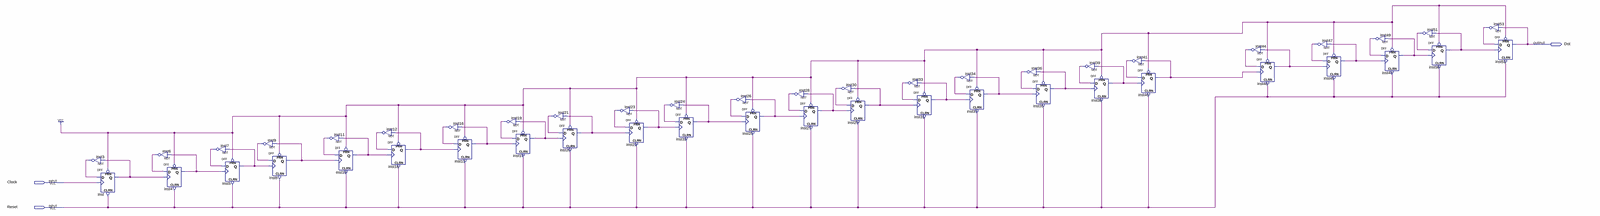
[diagram p0: schematic sheet, whole]
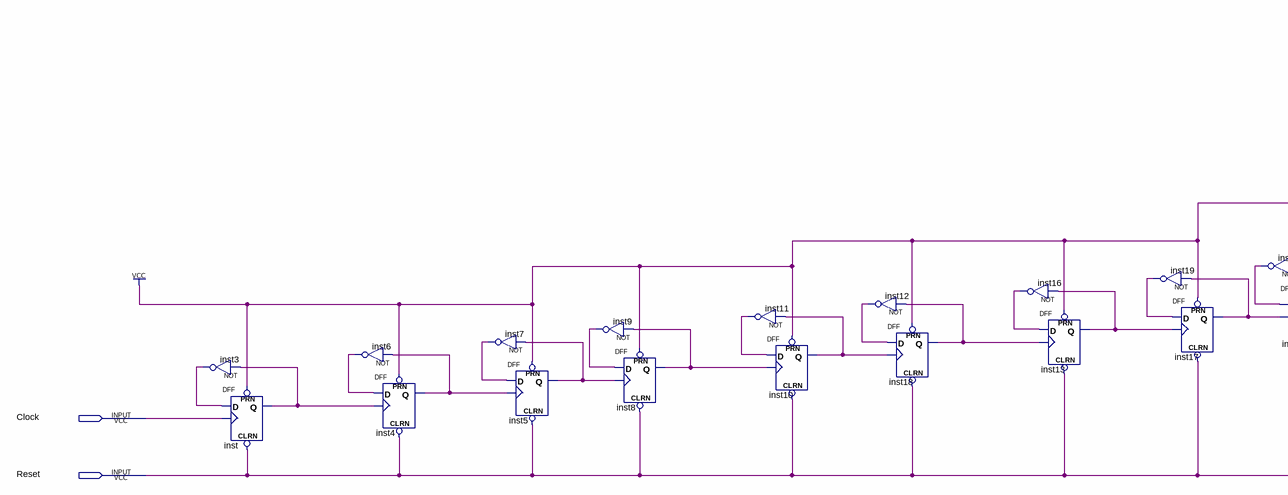
[diagram p1: schematic sheet, left part]
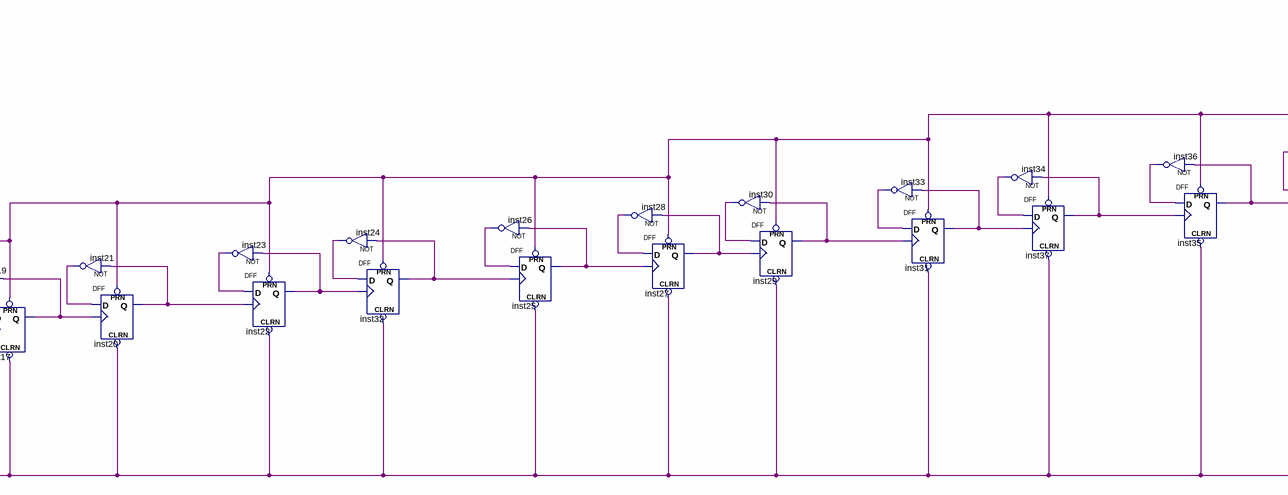
[diagram p2: schematic sheet, centre part]
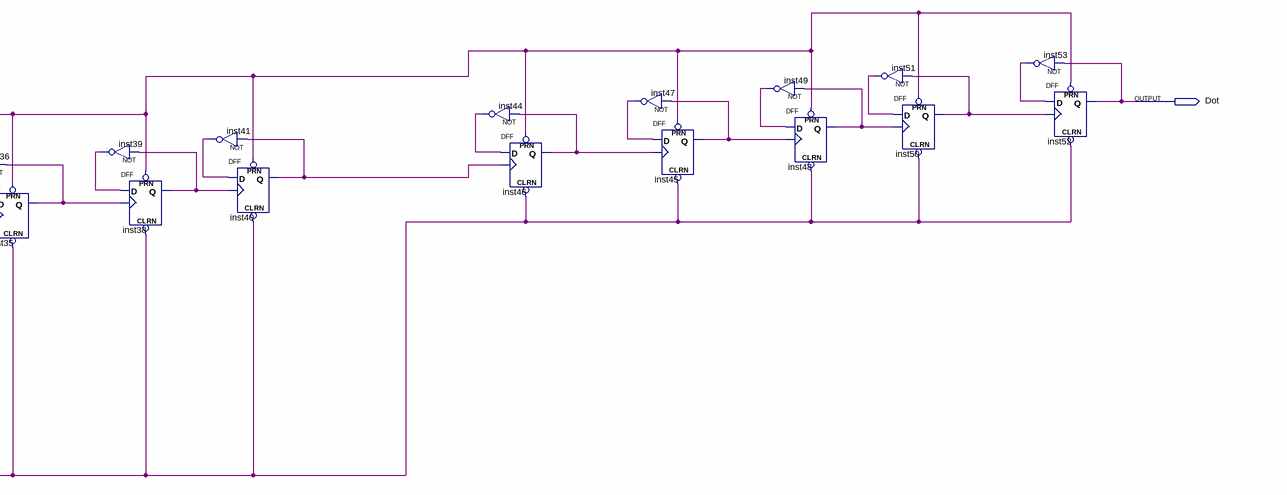
[diagram p3: schematic sheet, right part]
// Quartus schematic DivClock.bdf as structural Verilog: 48 symbols, 3 pins
module DivClock (
  input  Clock,
  input  Reset,
  output Dot
);

  wire inst3_out, inst4_q, inst5_q, inst6_out, inst7_out, inst8_q, inst9_out, inst10_q, inst11_out,
       inst12_out, inst13_q, inst16_out, inst17_q, inst18_q, inst19_out, inst20_q, inst21_out, inst22_q,
       inst23_out, inst24_out, inst25_q, inst26_out, inst27_q, inst28_out, inst29_q, inst30_out, inst31_q,
       inst32_q, inst33_out, inst34_out, inst35_q, inst36_out, inst37_q, inst38_q, inst39_out, inst40_q,
       inst41_out, inst44_out, inst45_q, inst46_q, inst47_out, inst48_q, inst49_out, inst50_q, inst51_out,
       inst53_out, inst_q;

  not inst3 (inst3_out, inst_q);
  DFF inst (.CLRN(Reset), .CLK(Clock), .D(inst3_out), .PRN(1'b1), .Q(inst_q));
  not inst6 (inst6_out, inst4_q);
  DFF inst4 (.CLRN(Reset), .CLK(inst_q), .D(inst6_out), .PRN(1'b1), .Q(inst4_q));
  not inst7 (inst7_out, inst5_q);
  DFF inst5 (.CLRN(Reset), .CLK(inst4_q), .D(inst7_out), .PRN(1'b1), .Q(inst5_q));
  not inst9 (inst9_out, inst8_q);
  DFF inst8 (.CLRN(Reset), .CLK(inst5_q), .D(inst9_out), .PRN(1'b1), .Q(inst8_q));
  not inst11 (inst11_out, inst10_q);
  DFF inst10 (.CLRN(Reset), .CLK(inst8_q), .D(inst11_out), .PRN(1'b1), .Q(inst10_q));
  not inst12 (inst12_out, inst18_q);
  DFF inst18 (.CLRN(Reset), .CLK(inst10_q), .D(inst12_out), .PRN(1'b1), .Q(inst18_q));
  not inst16 (inst16_out, inst13_q);
  DFF inst13 (.CLRN(Reset), .CLK(inst18_q), .D(inst16_out), .PRN(1'b1), .Q(inst13_q));
  not inst19 (inst19_out, inst17_q);
  DFF inst17 (.CLRN(Reset), .CLK(inst13_q), .D(inst19_out), .PRN(1'b1), .Q(inst17_q));
  not inst21 (inst21_out, inst20_q);
  DFF inst20 (.CLRN(Reset), .CLK(inst17_q), .D(inst21_out), .PRN(1'b1), .Q(inst20_q));
  not inst23 (inst23_out, inst22_q);
  DFF inst22 (.CLRN(Reset), .CLK(inst20_q), .D(inst23_out), .PRN(1'b1), .Q(inst22_q));
  not inst24 (inst24_out, inst32_q);
  DFF inst32 (.CLRN(Reset), .CLK(inst22_q), .D(inst24_out), .PRN(1'b1), .Q(inst32_q));
  not inst26 (inst26_out, inst25_q);
  DFF inst25 (.CLRN(Reset), .CLK(inst32_q), .D(inst26_out), .PRN(1'b1), .Q(inst25_q));
  not inst28 (inst28_out, inst27_q);
  DFF inst27 (.CLRN(Reset), .CLK(inst25_q), .D(inst28_out), .PRN(1'b1), .Q(inst27_q));
  not inst30 (inst30_out, inst29_q);
  DFF inst29 (.CLRN(Reset), .CLK(inst27_q), .D(inst30_out), .PRN(1'b1), .Q(inst29_q));
  not inst33 (inst33_out, inst31_q);
  DFF inst31 (.CLRN(Reset), .CLK(inst29_q), .D(inst33_out), .PRN(1'b1), .Q(inst31_q));
  not inst34 (inst34_out, inst37_q);
  DFF inst37 (.CLRN(Reset), .CLK(inst31_q), .D(inst34_out), .PRN(1'b1), .Q(inst37_q));
  not inst36 (inst36_out, inst35_q);
  DFF inst35 (.CLRN(Reset), .CLK(inst37_q), .D(inst36_out), .PRN(1'b1), .Q(inst35_q));
  not inst39 (inst39_out, inst38_q);
  DFF inst38 (.CLRN(Reset), .CLK(inst35_q), .D(inst39_out), .PRN(1'b1), .Q(inst38_q));
  not inst41 (inst41_out, inst40_q);
  DFF inst40 (.CLRN(Reset), .CLK(inst38_q), .D(inst41_out), .PRN(1'b1), .Q(inst40_q));
  not inst44 (inst44_out, inst46_q);
  DFF inst46 (.CLRN(Reset), .CLK(inst40_q), .D(inst44_out), .PRN(1'b1), .Q(inst46_q));
  not inst47 (inst47_out, inst45_q);
  DFF inst45 (.CLRN(Reset), .CLK(inst46_q), .D(inst47_out), .PRN(1'b1), .Q(inst45_q));
  not inst49 (inst49_out, inst48_q);
  DFF inst48 (.CLRN(Reset), .CLK(inst45_q), .D(inst49_out), .PRN(1'b1), .Q(inst48_q));
  not inst51 (inst51_out, inst50_q);
  DFF inst50 (.CLRN(Reset), .CLK(inst48_q), .D(inst51_out), .PRN(1'b1), .Q(inst50_q));
  not inst53 (inst53_out, Dot);
  DFF inst52 (.CLRN(Reset), .CLK(inst50_q), .D(inst53_out), .PRN(1'b1), .Q(Dot));
endmodule
